# Altium schematic sheet DRV8843.SchDoc
size A3
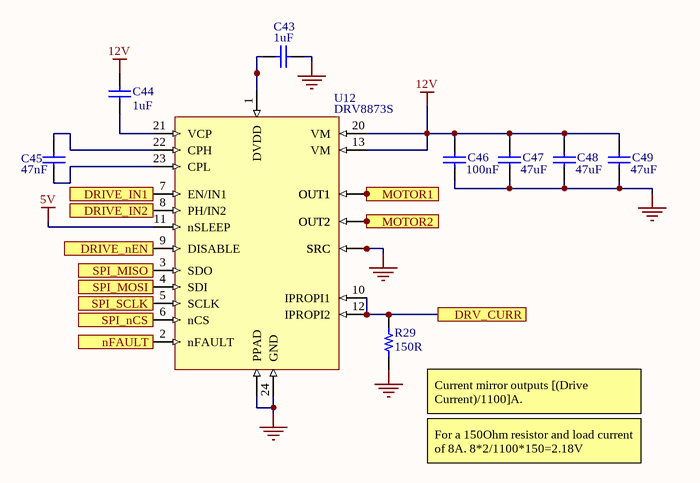
[diagram p0: DRV8843.SchDoc]

## Parts
C43  value 1uF  [0402]  (hidden comment: Cap)
C44  value 1uF  [0402]  (hidden comment: Cap)
C45  value 47nF  [0402]  (hidden comment: Cap)
C46  value 100nF  [0402]  (hidden comment: Cap)
C47  value 47uF  [1206]  (hidden comment: Cap)
C48  value 47uF  [1206]  (hidden comment: Cap)
C49  value 47uF  [1206]  (hidden comment: Cap)
R29  150R  [0805 - duplicate]
U12  DRV8873S  [HTSSOP24]

## Ports
DRIVE_IN1, DRIVE_IN2, DRIVE_nEN, DRV_CURR, MOTOR1, MOTOR2, nFAULT, SPI_MISO, SPI_MOSI, SPI_nCS, SPI_SCLK

## Nets
5V: U12.11(nSLEEP)
12V: C44.2 C46.2 C47.2 C48.2 C49.2 U12.13(VM) U12.20(VM)
GND: C43.2 C46.1 C47.1 C48.1 C49.1 R29.1 U12.16(SRC) U12.17(SRC) U12.24(GND) U12.THERM(PPAD)
DRIVE_IN1: U12.7(EN/IN1) ; port DRIVE_IN1
DRIVE_IN2: U12.8(PH/IN2) ; port DRIVE_IN2
DRIVE_nEN: U12.9(DISABLE) ; port DRIVE_nEN
DRV_CURR: R29.2 U12.10(IPROPI1) U12.12(IPROPI2) ; port DRV_CURR
MOTOR1: U12.18(OUT1) U12.19(OUT1) ; port MOTOR1
MOTOR2: U12.14(OUT2) U12.15(OUT2) ; port MOTOR2
nFAULT: U12.2(nFAULT) ; port nFAULT
SPI_MISO: U12.3(SDO) ; port SPI_MISO
SPI_MOSI: U12.4(SDI) ; port SPI_MOSI
SPI_nCS: U12.6(nCS) ; port SPI_nCS
SPI_SCLK: U12.5(SCLK) ; port SPI_SCLK
NetC43_1: C43.1 U12.1(DVDD)
NetC44_1: C44.1 U12.21(VCP)
NetC45_1: C45.1 U12.23(CPL)
NetC45_2: C45.2 U12.22(CPH)

## Notes on the sheet
- (near R29) Current mirror outputs [(Drive Current)/1100]A.
- For a 150Ohm resistor and load current of 8A. 8*2/1100*150=2.18V

## Library data of the parts
R29 = Resistor
C43-C49 = Cap: Published: 8-Jun-2000; LatestRevisionDate: 17-Jul-2002; LatestRevisionNote: Re-released for DXP Platform.; PackageReference: RAD-0.3; Publisher: Altium Limited; PackageDescription: Radial Cap, Thru-Hole; 2 Leads; 0.3 in Pin Spacing